# Altium project 2014 10 1 主控 KL25Z128VLK4.PRJPCB
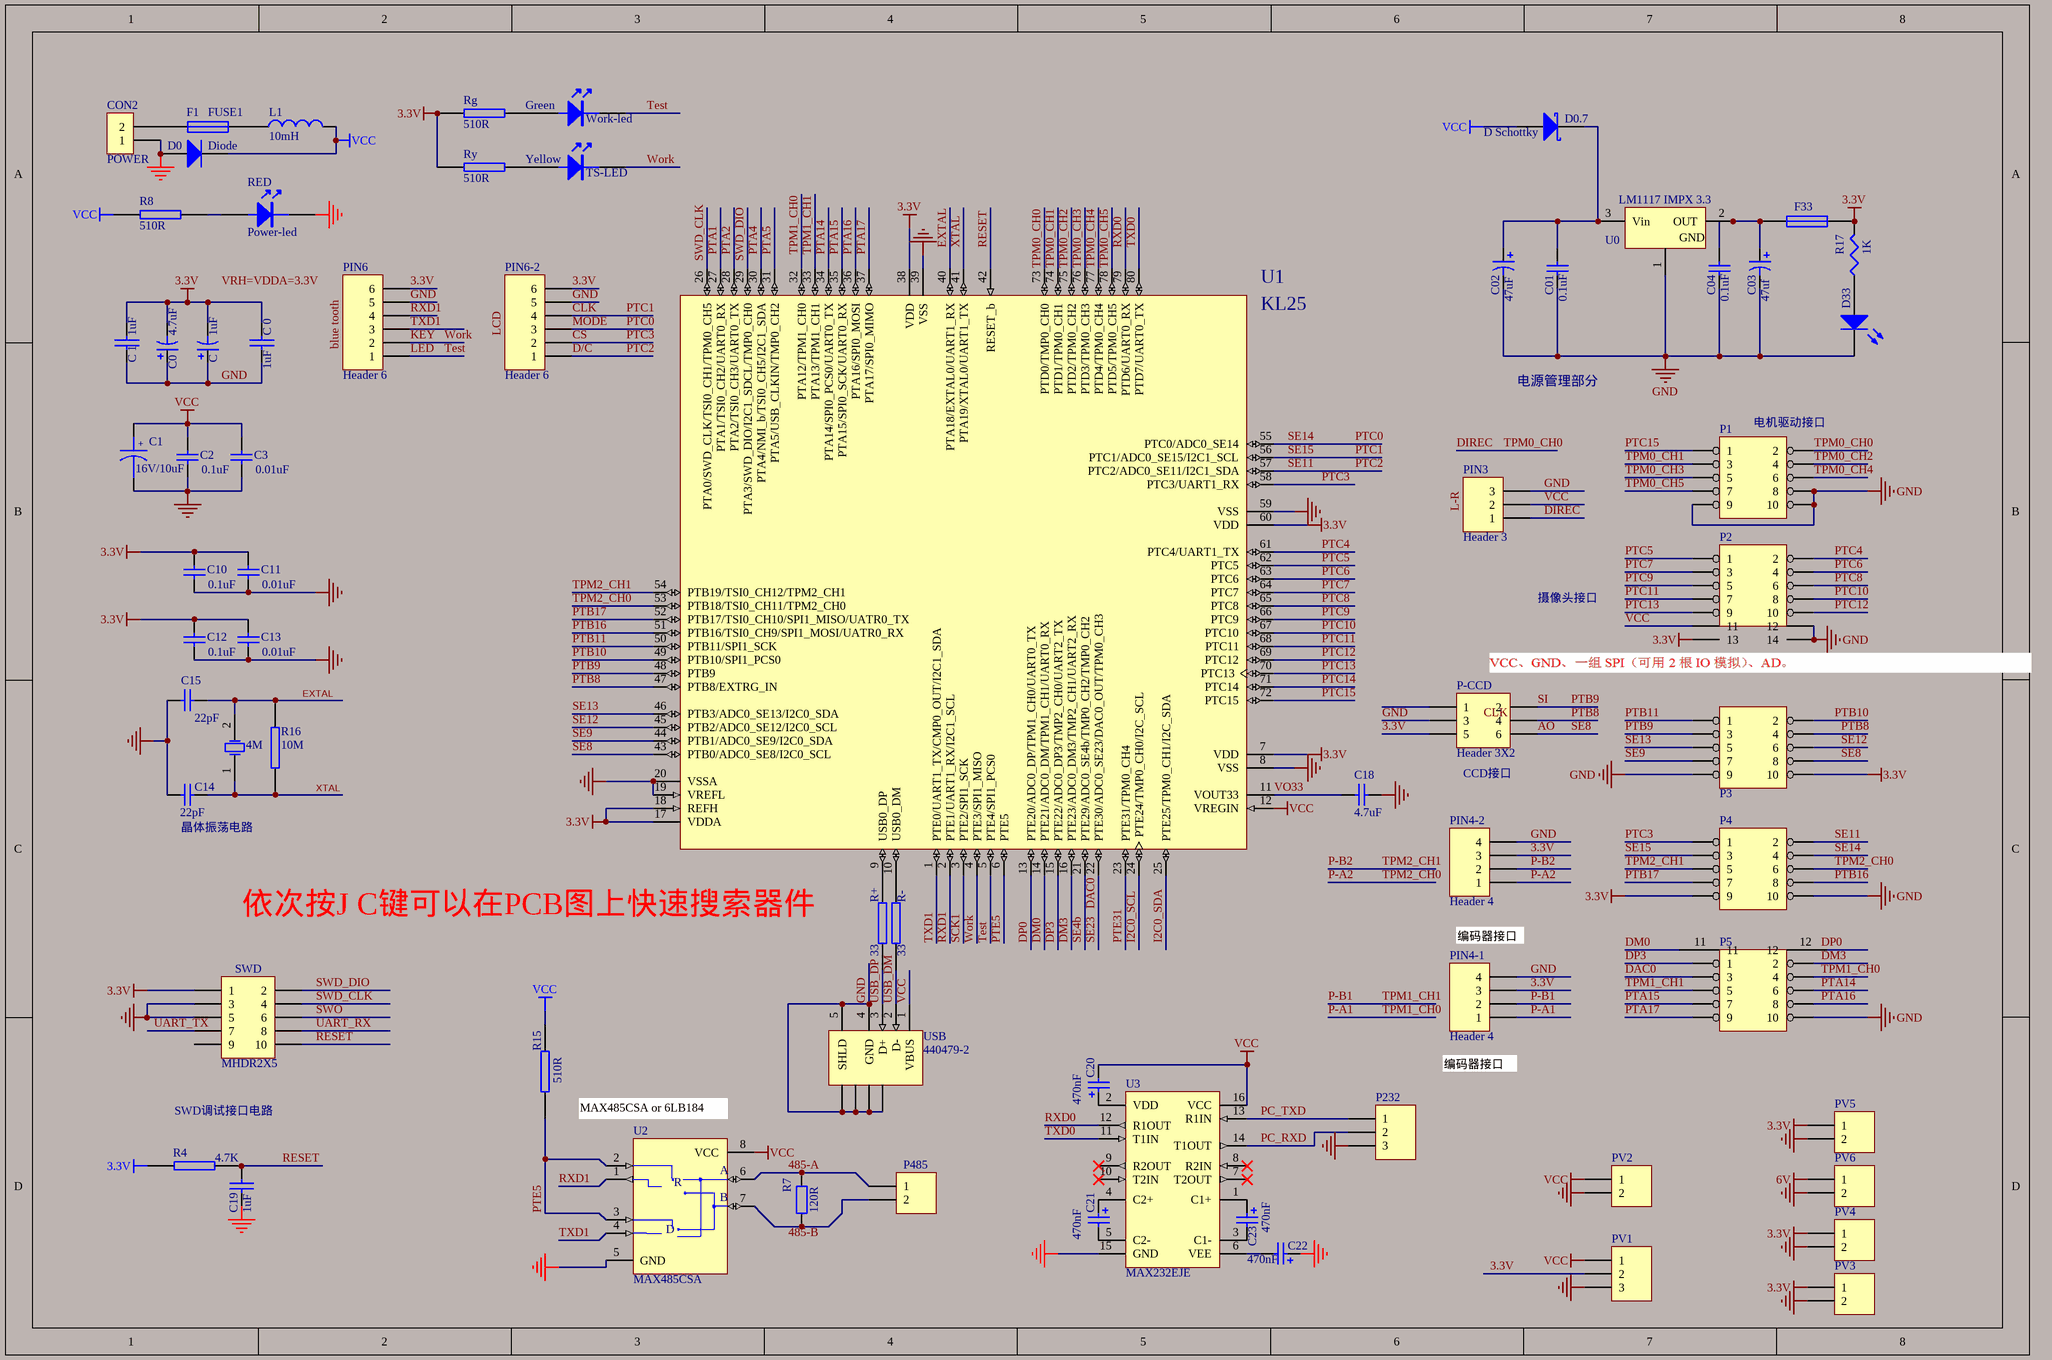
[diagram p0: 2014 10 1 主控板 KL25Z128VLK4.SCHDOC]
1 sheet, 69 parts. Net scope: global (net labels, ports and power ports of the same name join across sheets).
Board file: 2014 10 1 主控板 KL25Z128VLK4.PCBDOC

## Sheet 2014 10 1 主控板 KL25Z128VLK4.SCHDOC
size 381 x 254 mm; SheetNumber: 0; SheetTotal: 0; PageSetup: Record=PageOptions|CenterHorizontal=True|CenterVertical=True|PrintScale=0.59|XCorrection=1.00|YCorrection=1.00|PrintKind=1|BorderSize=5000000|LeftOffset=0|BottomOffset=0|Orientation=1|PaperLength=1000|PaperWidth=1000|Scale=100|PaperSource=7|PrintQuality=-4|MediaType=1|DitherType=10|PaperKind=A4|PrintScaleMode=1

### Parts
4M  XTAL  [XTAL1]  (value not drawn)
C  value 1uF  [1812]  (hidden comment: Cap Pol3)
C0  value 4.7uF  [1812]  (hidden comment: Cap Pol3)
C1  16V/10uF  [1206]
C01  value 0.1uF  [1608[0603]]  (hidden comment: C1)
C2  value 0.1uF  [2012[0805]]
C02  47uf  [CAPR5-4X5]
C3  value 0.01uF  [2012[0805]]
C03  47uf  [RAD-0.1]
C04  value 0.1uF  [1608[0603]]  (hidden comment: C1)
C10  value 0.1uF  [0805]
C11  value 0.01uF  [2012[0805]]
C12  value 0.1uF  [2012[0805]]
C13  value 0.01uF  [2012[0805]]
C14  22pF  [2012[0805]]
C15  22pF  [2012[0805]]
C18  value 4.7uF  [3225[1210]]
C19  1uF  [2012[0805]]
C20  470nF  [0805]
C21  470nF  [0805]
C22  470nF  [0805]
C23  470nF  [0805]
C_0  1uF  [2012[0805]]
C_1  1uF  [2012[0805]]
CON2  POWER  [CON2]
D0  Diode  [SMC]
D0.7  D Schottky  [SMB]
D33  (no value)  [LED-1206]
F1  FUSE1  [RAD0.3]
F33  Fuse 1  [C1206]  (value not drawn)
Green  Work-led  [LED-1206]
L1  10mH  [0805]
P1  JTAG  [IDC10S]  (value not drawn)
P2  JTAG  [IDC10S]  (value not drawn)
P3  JTAG  [IDC10S]  (value not drawn)
P4  JTAG  [IDC10S]  (value not drawn)
P5  JTAG  [IDC10S]  (value not drawn)
P232  Header 3  [HDR1X3]  (value not drawn)
P485  Header 2  [HDR1X2]  (value not drawn)
P-CCD  Header 3X2  [HDR2X3]
PIN3  Header 3  [HDR1X3]
PIN4-1  Header 4  [HDR1X4]
PIN4-2  Header 4  [HDR1X4]
PIN6  Header 6  [HDR1X6]
PIN6-2  Header 6  [HDR1X6]
PV1  Header 3  [HDR1X3]  (value not drawn)
PV2  Header 2  [HDR1X2]  (value not drawn)
PV3  Header 2  [HDR1X2]  (value not drawn)
PV4  Header 2  [HDR1X2]  (value not drawn)
PV5  Header 2  [HDR1X2]  (value not drawn)
PV6  Header 2  [HDR1X2]  (value not drawn)
R4  4.7K  [2012[0805]]
R7  120R  [2012[0805]]
R8  510R  [2012[0805]]
R15  510R  [0805]
R16  10M  [2012[0805]]
R17  value 1K  [2012[0805]]  (hidden comment: Res3)
R+  33  [2012[0805]]
R-  33  [2012[0805]]
RED  Power-led  [LED-1206]
Rg  510R  [0805]
Ry  510R  [0805]
SWD  MHDR2X5  [MHDR2X5]
U0  LM1117 IMPX 3.3  [SOT89]
U1  KL25  [MCU9S12]
U2  MAX485CSA  [max485]
U3  MAX232EJE  [MAX232]
USB  440479-2  [440479]
Yellow  TS-LED  [LED-1206]

### Nets
3.3V: C.2 C0.2 C10.2 C11.2 C12.2 C13.2 C_0.1 C_1.1 F33.2 P2.13 P3.10 P4.9 P-CCD.5 PIN4-1.3 PIN4-2.3 PIN6.6 PIN6-2.6 PV1.2 PV3.1 PV4.1 PV5.1 R4.1 R17.2 Rg.2 Ry.2 SWD.1 U1.7(VDD) U1.17(VDDA) U1.18(REFH) U1.38(VDD) U1.60(VDD)
6V: PV6.1
GND: C.1 C0.1 C01.1 C1.2 C2.1 C02.2 C3.1 C03.2 C04.1 C10.1 C11.1 C12.1 C13.1 C14.2 C15.1 C18.1 C19.2 C22.1 C_0.2 C_1.2 CON2.1 D0.1(A) D33.2(K) P1.8 P1.9 P1.10 P2.12 P2.14 P3.9 P4.10 P5.10 P232.3 P-CCD.3 PIN3.3 PIN4-1.4 PIN4-2.4 PIN6.5 PIN6-2.5 PV1.3 PV2.2 PV3.2 PV4.2 PV5.2 PV6.2 RED.2 SWD.3 SWD.5 U0.1(Vin) U1.8(VSS) U1.19(VREFL) U1.20(VSSA) U1.39(VSS) U1.59(VSS) U2.5(GND) U3.15(GND) USB.4(GND) USB.5(SHLD) USB.6(SHLD) USB.7(SHLD) USB.8(SHLD) USB.9(SHLD)
VCC: C1.1 C2.2 C3.2 C20.2 D0.2(K) D0.7.1(A) L1.2 P2.11 PIN3.2 PV1.1 PV2.1 R8.2 R15.2 U1.12(VREGIN) U2.8(VCC) U3.16(VCC) USB.1(VBUS)
485-A: P485.1 R7.2 U2.6(A)
AO: P3.8 P-CCD.6 U1.43(PTB0/ADC0_SE8/I2C0_SCL)  [also labelled SE8]
CLK: P4.3 PIN6-2.4 U1.56(PTC1/ADC0_SE15/I2C1_SCL)  [also labelled PTC1, SE15]
CS: P4.1 PIN6-2.2 U1.58(PTC3/UART1_RX)  [also labelled PTC3]
D/C: P4.2 PIN6-2.1 U1.57(PTC2/ADC0_SE11/I2C1_SDA)  [also labelled PTC2, SE11]
DAC0: P5.3 U1.22(PTE30/ADC0_SE23/DAC0_OUT/TPM0_CH3)  [also labelled SE23]
DIREC: P1.2 PIN3.1 U1.73(PTD0/TMP0_CH0)  [also labelled TPM0_CH0]
DM0: P5.11 U1.14(PTE21/ADC0_DM/TPM1_CH1/UART0_RX)
DM3: P5.2 U1.16(PTE23/ADC0_DM3/TMP2_CH1/UART2_RX)
DP0: U1.13(PTE20/ADC0_DP/TPM1_CH0/UART0_TX)
DP3: P5.1 U1.15(PTE22/ADC0_DP3/TMP2_CH0/UART2_TX)
EXTAL: 4M.2(OSC2) C15.2 R16.2 U1.40(PTA18/EXTAL0/UART1_RX)
I2C0_SCL: U1.24(PTE24/TMP0_CH0/I2C_SCL)
I2C0_SDA: U1.25(PTE25/TPM0_CH1/I2C_SDA)
KEY: PIN6.2 U1.4(PTE3/SPI1_MISO) Yellow.2  [also labelled Work]
LED: Green.2 PIN6.1 U1.5(PTE4/SPI1_PCS0)  [also labelled Test]
MODE: P4.4 PIN6-2.3 U1.55(PTC0/ADC0_SE14)  [also labelled PTC0, SE14]
P-A1: P5.4 PIN4-1.1 U1.32(PTA12/TPM1_CH0)  [also labelled TPM1_CH0]
P-A2: P4.6 PIN4-2.1 U1.53(PTB18/TSI0_CH11/TPM2_CH0)  [also labelled TPM2_CH0]
P-B1: P5.5 PIN4-1.2 U1.33(PTA13/TPM1_CH1)  [also labelled TPM1_CH1]
P-B2: P4.5 PIN4-2.2 U1.54(PTB19/TSI0_CH12/TPM2_CH1)  [also labelled TPM2_CH1]
PC_RXD: P232.2 U3.14(T1OUT)
PC_TXD: P232.1 U3.13(R1IN)
PTA1: U1.27(PTA1/TSI0_CH2/UART0_RX)
PTA2: U1.28(PTA2/TSI0_CH3/UART0_TX)
PTA4: U1.30(PTA4/NMI_b/TSI0_CH5/I2C1_SDA)
PTA5: U1.31(PTA5/USB_CLKIN/TMP0_CH2)
PTA14: P5.6 U1.34(PTA14/SPI0_PCS0/UART0_TX)
PTA15: P5.7 U1.35(PTA15/SPI0_SCK/UART0_RX)
PTA16: P5.8 U1.36(PTA16/SPI0_MOSI)
PTA17: P5.9 U1.37(PTA17/SPI0_MIMO)
PTB8: P3.4 P-CCD.4 U1.47(PTB8/EXTRG_IN)
PTB9: P3.3 P-CCD.2 U1.48(PTB9)  [also labelled SI]
PTB10: P3.2 U1.49(PTB10/SPI1_PCS0)
PTB11: P3.1 U1.50(PTB11/SPI1_SCK)
PTB16: P4.8 U1.51(PTB16/TSI0_CH9/SPI1_MOSI/UATR0_RX)
PTB17: P4.7 U1.52(PTB17/TSI0_CH10/SPI1_MISO/UATR0_TX)
PTC4: P2.2 U1.61(PTC4/UART1_TX)
PTC5: P2.1 U1.62(PTC5)
PTC6: P2.4 U1.63(PTC6)
PTC7: P2.3 U1.64(PTC7)
PTC8: P2.6 U1.65(PTC8)
PTC9: P2.5 U1.66(PTC9)
PTC10: P2.8 U1.67(PTC10)
PTC11: P2.7 U1.68(PTC11)
PTC12: P2.10 U1.69(PTC12)
PTC13: P2.9 U1.70(PTC13)
PTC14: U1.71(PTC14)
PTC15: P1.1 U1.72(PTC15)
PTE5: R15.1 U1.6(PTE5) U2.2(~{RE}) U2.3(DE)
PTE31: U1.23(PTE31/TPM0_CH4)
RESET: C19.1 R4.2 SWD.10 U1.42(RESET_b)
RXD0: U1.79(PTD6/UART0_RX) U3.12(R1OUT)
RXD1: PIN6.4 U1.2(PTE1/UART1_RX/I2C1_SCL) U2.1(RO)
SCK1: U1.3(PTE2/SPI1_SCK)
SE4b: U1.21(PTE29/ADC0_SE4b/TMP0_CH2/TMP0_CH2)
SE9: P3.7 U1.44(PTB1/ADC0_SE9/I2C0_SDA)
SE12: P3.6 U1.45(PTB2/ADC0_SE12/I2C0_SCL)
SE13: P3.5 U1.46(PTB3/ADC0_SE13/I2C0_SDA)
SWD_CLK: SWD.4 U1.26(PTA0/SWD_CLK/TSI0_CH1/TPM0_CH5)
SWD_DIO: SWD.2 U1.29(PTA3/SWD_DIO/I2C1_SDCL/TMP0_CH0)
SWO: SWD.6
TPM0_CH1: P1.3 U1.74(PTD1/TPM0_CH1)
TPM0_CH2: P1.4 U1.75(PTD2/TPM0_CH2)
TPM0_CH3: P1.5 U1.76(PTD3/TPM0_CH3)
TPM0_CH4: P1.6 U1.77(PTD4/TPM0_CH4)
TPM0_CH5: P1.7 U1.78(PTD5/TPM0_CH5)
TXD0: U1.80(PTD7/UART0_TX) U3.11(T1IN)
TXD1: PIN6.3 U1.1(PTE0/UART1_TX/CMP0_OUT/I2C1_SDA) U2.4(DI)
UART_RX: SWD.8
UART_TX: SWD.7
USB_DM: R-.1 USB.2(D-)
USB_DP: R+.1 USB.3(D+)
VO33: C18.2 U1.11(VOUT33)
XTAL: 4M.1(OSC1) C14.1 R16.1 U1.41(PTA19/XTAL0/UART1_TX)
NetC01_2: C01.2 C02.1 D0.7.2(K) U0.3(Vin)
NetC03_1: C03.1 C04.2 F33.1 U0.2(OUT)
NetC20_1: C20.1 U3.2(VDD)
NetC21_1: C21.1 U3.4(C2+)
NetC21_2: C21.2 U3.5(C2-)
NetC22_2: C22.2 U3.6(VEE)
NetC23_1: C23.1 U3.1(C1+)
NetC23_2: C23.2 U3.3(C1-)
NetCON2_2: CON2.2 F1.1
NetD33_1: D33.1(A) R17.1
NetF1_2: F1.2 L1.1
NetGreen_1: Green.1 Rg.1
NetP485_2: P485.2 R7.1 U2.7(B)
NetR8_1: R8.1 RED.1
NetR+_2: R+.2 U1.9(USB0_DP)
NetR-_2: R-.2 U1.10(USB0_DM)
NetRy_1: Ry.1 Yellow.1

Not connected (* = marked no-connect by the designer): P5 12; P-CCD 1; SWD 9; U3 7(T2OUT)* 8(R2IN)* 9(R2OUT)* 10(T2IN)*

### Notes on the sheet
- 电源管理部分
- (near P1) 电机驱动接口
- 摄像头接口
- (near C14) 晶体振荡电路
- (near P-CCD) CCD接口
- 依次按J C键可以在PCB图上快速搜索器件
- 编码器接口
- SWD调试接口电路
- MAX485CSA or 6LB184
- (near PIN4-1) 编码器接口
- Labels drawn without touching a wire or pin: 485-B, blue tooth, CLK, DP0, L-R, LCD, VRH=VDDA=3.3V
- (in symbol CAPACITOR POL) +
- (in symbol MAX485CSA) R; D
- (in symbol Volt Reg) GND

### Library data of the parts
4M = XTAL: Crystal Oscillator; Published: *; LatestRevisionDate: *; LatestRevisionNote: *; PackageReference: *; Publisher: *
C C0 C02 = Cap Pol3: Polarized Capacitor (Surface Mount); Published: 8-Jun-2000; LatestRevisionDate: 17-Jul-2002; LatestRevisionNote: Re-released for DXP Platform.; PackageReference: C0805; Publisher: Altium Limited
  C02: Value: 47uF
C1 = CAPACITOR POL: Capacitor
C01 C04 = Cap Semi: Capacitor (Semiconductor SIM Model); Published: 8-Jun-2000; LatestRevisionDate: 17-Jul-2002; LatestRevisionNote: Re-released for DXP Platform.; PackageReference: C1206; Publisher: Altium Limited
C2 C3 C10-C15 C18 = Cap: Capacitor
  C2 C3 C10-C13 C18: Published: 8-Jun-2000; LatestRevisionDate: 17-Jul-2002; LatestRevisionNote: Re-released for DXP Platform.; PackageReference: RAD-0.3; Publisher: Altium Limited
  C14 C15: Published: *; LatestRevisionDate: *; LatestRevisionNote: *; PackageReference: *; Publisher: *; Value: 22pF
C03 = Cap Pol1: Polarized Capacitor (Radial); Published: 8-Jun-2000; LatestRevisionDate: 17-Jul-2002; LatestRevisionNote: Re-released for DXP Platform.; Publisher: Altium Limited
C19 C_0 C_1 = CAP: Capacitor
C20-C23 = 1-CAP-POL-MY: Polarized Capacitor (Axial); Manufacturer: Generic Components; Class: Passive; Value: 100pF; Published: 08/06/2000; Publisher: Altium Hobart Technology Centre; SubClass: Capacitor
CON2 = CON2: Connector
D0 = Diode: Default Diode; Published: 8-Jun-2000; LatestRevisionDate: 17-Jul-2002; LatestRevisionNote: Re-released for DXP Platform.; PackageDocument: Sep-1996; PackageReference: SMC; Publisher: Altium Limited; Code_JEDEC: DO-214-AB
D0.7 = D Schottky: Schottky Diode; Published: 8-Jun-2000; LatestRevisionDate: 17-Jul-2002; LatestRevisionNote: Re-released for DXP Platform.; PackageReference: SMB; Publisher: Altium Limited; Code_JEDEC: DO-214-AA
D33 = LED3: Typical BLUE SiC LED; Published: 8-Jun-2000; LatestRevisionDate: 17-Dec-2003; LatestRevisionNote: PCB Footprint replaced.; DatasheetDocument: 16-Apr-2002; PackageDocument: 16-Apr-2002; PackageReference: 3.5X2.8X1.9; Publisher: Altium Limited
F1 = FUSE1: Fuse
F33 = Fuse 1: Fuse; Published: 8-Jun-2000; LatestRevisionDate: 17-Jul-2002; LatestRevisionNote: Re-released for DXP Platform.; PackageReference: PIN-W2/E2.8; Publisher: Altium Limited
Green RED Yellow = LED
L1 = Inductor: Code_IEC: 1005; Published: 8-Jun-2000; LatestRevisionDate: 17-Jul-2002; LatestRevisionNote: Re-released for DXP Platform.; PackageReference: 0402-A; Publisher: Altium Limited; Code_JEITA: 0402; Value: 10mH
P1-P5 = HEADER 5X2_2
P232 PIN3 PV1 = Header 3: Header, 3-Pin; LatestRevisionDate: 17-Jul-2002; LatestRevisionNote: Re-released for DXP Platform.; Publisher: Altium Limited
P485 PV2-PV6 = Header 2: Header, 2-Pin; LatestRevisionDate: 17-Jul-2002; LatestRevisionNote: Re-released for DXP Platform.; Publisher: Altium Limited
P-CCD = Header 3X2: Header, 3-Pin, Dual row; LatestRevisionDate: 17-Jul-2002; LatestRevisionNote: Re-released for DXP Platform.; Publisher: Altium Limited
PIN4-1 PIN4-2 = Header 4: Header, 4-Pin; LatestRevisionDate: 17-Jul-2002; LatestRevisionNote: Re-released for DXP Platform.; Publisher: Altium Limited
PIN6 PIN6-2 = Header 6: Header, 6-Pin; LatestRevisionDate: 17-Jul-2002; LatestRevisionNote: Re-released for DXP Platform.; Publisher: Altium Limited
R4 R8 R15 R16 R+ R- Rg Ry = RES2
R7 = 1-RES-MY: Resistor; Published: *; Publisher: *; Manufacturer: *; Class: *; SubClass: *; Value: *
R17 = Res3: Resistor; Published: 8-Jun-2000; LatestRevisionDate: 04-Mar-2005; LatestRevisionNote: PCB Footprint replaced.; PackageReference: J1-0603; Publisher: Altium Limited
SWD = MHDR2X5: Header, 5-Pin, Dual row; LatestRevisionDate: 17-Jul-2002; LatestRevisionNote: Re-released for DXP Platform.; Publisher: Altium Limited
U0 = Volt Reg: Voltage Regulator; Published: 24-Mar-1999; LatestRevisionDate: 17-Jul-2002; LatestRevisionNote: Re-released for DXP Platform.; PackageReference: D2PAK; Publisher: Altium Limited; Code_JEDEC: SMD-220
U1 = MC9S12DG128BVFU: 16-Bit Microcontroller; Published: 21-Mar-2003; LatestRevisionDate: 13-Apr-2006; LatestRevisionNote: IPC-7351 Footprint Added.; DatasheetVersion: 16-Aug-2002; PackageVersion: 2000; PackageReference: 841B; Publisher: Altium Limited; PackageDescription: 80-Pin Plastic Quad Flat Pack 0.65 mm Pitch; Code_IPC: QFP65P1720X1720-80; ComponentLink1Description: Manufacturer Link; ComponentLink1URL: http://www.freescale.com/; ComponentLink2Description: Datasheet; ComponentLink2URL: http://www.freescale.com/files/microcontrollers/doc/data_sheet/9S12DT128BDGV1.pdf
U2 = MAX485CSA: Low-Power, Slew-Rate-Limited RS-485/RS-422 Transceiver; Published: 16-Jan-2001; LatestRevisionDate: 13-Apr-2006; LatestRevisionNote: IPC-7351 Footprint Added.; DatasheetVersion: Feb-1996; PackageReference: NSO8; Publisher: Altium Limited; PackageDescription: 8-Pin Small Outline Integrated Circuit 1.27 mm Pitch; Code_JEDEC: MS-012-AA; Code_IPC: SOIC127P600-8; ComponentLink1Description: Manufacturer Link; ComponentLink1URL: http://www.maxim-ic.com/; ComponentLink2Description: Datasheet; ComponentLink2URL: http://pdfserv.maxim-ic.com/en/ds/MAX1487-MAX491.pdf
U3 = MAX232EJE: +5V Powered RS-232 Driver/Receiver; PackageDocument: 1996; Published: 16-Jan-2001; LatestRevisionDate: 6-Jun-2005; LatestRevisionNote: Stylized 3D Model Added.; DatasheetDocument: Apr-1992; PackageReference: JE16; Publisher: Altium Limited; ComponentLink1Description: Manufacturer Link; ComponentLink1URL: http://www.maxim-ic.com/; ComponentLink2Description: Datasheet; ComponentLink2URL: http://pdfserv.maxim-ic.com/en/ds/MAX220-MAX249.pdf
USB = 440479-2: USB 2.0, Right Angle, SMT, AB Type, Receptacle, 5 Position, Black; ContactMaterial: Phosphor Bronze; ContactPlating: Gold (30) over Nickel; PCB_Layout: Complies with manufacturer's recommendation.; DrillSize: Corresponds to nominal value.; PanelGround: Without; Published: 15-Jul-2004; DatasheetDocument: 28-Jan-2003; PackageDocument: 28-Jan-2003; PackageReference: 440479; Publisher: Altium Limited; HousingMaterial: Thermoplastic; ComponentLink1Description: Manufacturer Link; ComponentLink1URL: http://www.tycoelectronics.com/; ComponentLink2Description: Packaging Specification; ComponentLink2URL: http://ecommas.tycoelectronics.com/commerce/DocumentDelivery/DDEController?Action=showdoc&DocId=Customer+Drawing%7F440479%7FD%7Fpdf%7FEnglish%7FC_440479_D.pdf